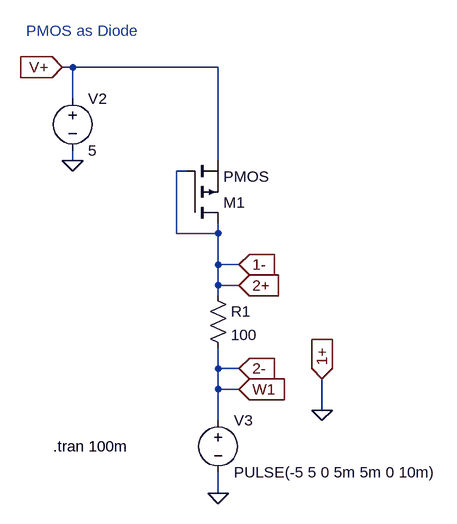
[diagram p0: schematic pmos_diode_ltspice.asc]
pmos_diode_ltspice.asc, the LTspice schematic file:
Version 4
SHEET 1 880 680
WIRE 0 -16 -16 -16
WIRE 224 -16 0 -16
WIRE 0 32 0 -16
WIRE 0 128 0 112
WIRE 224 128 224 -16
WIRE 176 144 160 144
WIRE 160 240 160 144
WIRE 224 240 224 224
WIRE 224 240 160 240
WIRE 224 288 224 240
WIRE 256 288 224 288
WIRE 224 320 224 288
WIRE 256 320 224 320
WIRE 224 336 224 320
WIRE 224 448 224 416
WIRE 256 448 224 448
WIRE 224 480 224 448
WIRE 256 480 224 480
WIRE 384 512 384 464
WIRE 224 528 224 480
WIRE 224 640 224 608
FLAG 224 640 0
FLAG 256 480 W1
IOPIN 256 480 In
FLAG 384 512 0
FLAG 384 464 1+
IOPIN 384 464 In
FLAG 0 128 0
FLAG -16 -16 V+
IOPIN -16 -16 In
FLAG 256 448 2-
IOPIN 256 448 In
FLAG 256 320 2+
IOPIN 256 320 In
FLAG 256 288 1-
IOPIN 256 288 In
SYMBOL voltage 0 16 R0
WINDOW 123 0 0 Left 0
WINDOW 39 0 0 Left 0
SYMATTR InstName V2
SYMATTR Value 5
SYMBOL voltage 224 512 R0
WINDOW 123 0 0 Left 0
WINDOW 39 0 0 Left 0
SYMATTR InstName V3
SYMATTR Value PULSE(-5 5 0 5m 5m 0 10m)
SYMBOL pmos 176 224 M180
SYMATTR InstName M1
SYMBOL res 208 320 R0
SYMATTR InstName R1
SYMATTR Value 100
TEXT -30 568 Left 2 !.tran 100m
TEXT -72 -72 Left 2 ;PMOS as Diode

The netlist it stands for:
* pmos_diode_ltspice.asc
V2 V+ 0 5
V3 2- 0 PULSE(-5 5 0 5m 5m 0 10m)
M1 1- 1- V+ V+ PMOS
R1 1- 2- 100
.model NMOS NMOS
.model PMOS PMOS
.lib standard.mos
.tran 100m
* PMOS as Diode
.backanno
.end